# Altium project PT_PowerBench.PrjPcb
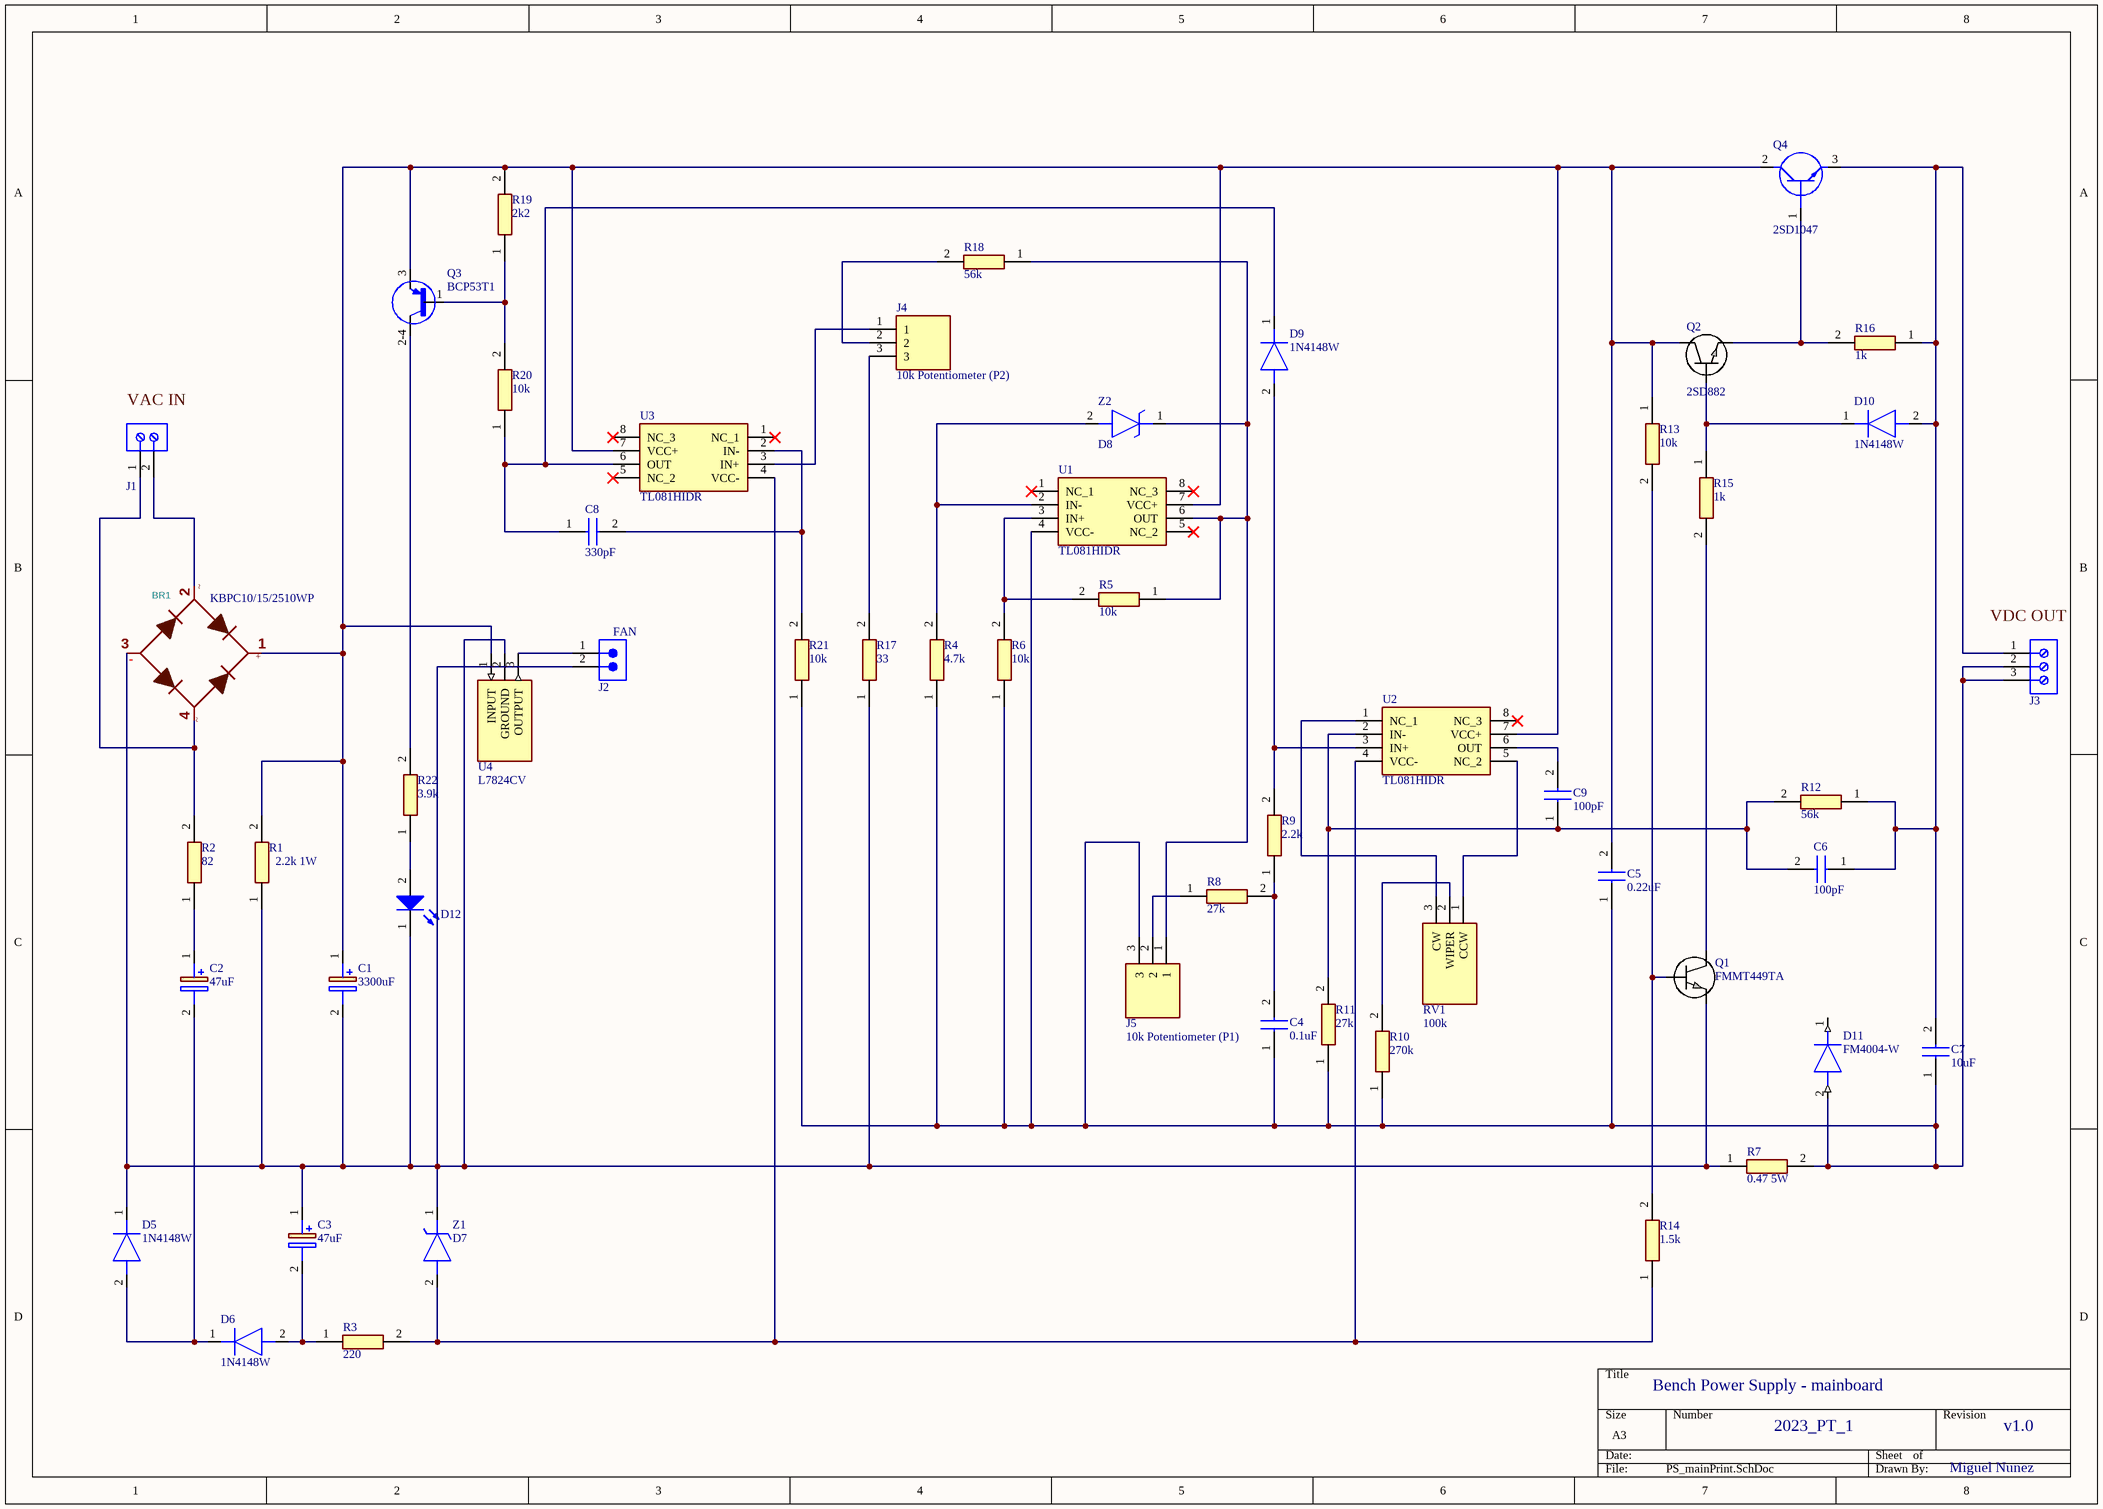
[diagram p0: PS_mainPrint.SchDoc]
2 sheets, 54 parts. Net scope: global (net labels, ports and power ports of the same name join across sheets).
Board file: PS_mainPcb.PcbDoc
Sheets:
  PS_mainPrint.SchDoc
  PS_voltAmpMeterPrint.SchDoc

## Sheet PS_mainPrint.SchDoc
size A3; SheetNumber: 1; SheetTotal: 1

### Parts
BR1  KBPC10/15/2510WP  [KBPCxxxxWP]
C1  3300uF  [CAPPRD500W60D1050H1350]
C2  47uF  [CAPPRD750W80D1850H4250]
C3  47uF  [CAPPRD750W80D1850H4250]
C4  0.1uF  [CAPC2012X145N]
C5  0.22uF  [CAPC2012X145N]
C6  100pF  [CAPC2012X145N]
C7  10uF  [CAPC2012X145N]
C8  330pF  [CAPC2012X145N]
C9  100pF  [CAPC2012X145N]
D5  1N4148W  [SOD3816X135N]
D6  1N4148W  [SOD3816X135N]
D9  1N4148W  [SOD3816X135N]
D10  1N4148W  [SOD3816X135N]
D11  FM4004-W  [DIONM5025X231N]
D12  Blue, 3.2V, 140°  [WL-SMCW_0805_150080xx75000]  (value not drawn)
J1  24VAC INPUT  [691103110002]  (value not drawn)
J2  FAN  [61900211121]
J3  TermBlock 3p  [691103110003]  (value not drawn)
J4  10k Potentiometer (P2)  [SHDR3W79P0X254_1X3_762X580X1175P]
J5  10k Potentiometer (P1)  [SHDR3W79P0X254_1X3_762X580X1175P]
Q1  FMMT449TA  [SOT-23_2P9X1P3_DIO]
Q2  2SD882  [SOT-32_STM]
Q3  BCP53T1  [TRANS_BCP53T1]
Q4  2SD1047  [TO545P500X1560X2360-3P]
R1  2.2k 1W  [RESC5025X70N]
R2  82  [RESC2012X60N]
R3  220  [RESC2012X60N]
R4  4.7k  [RESC2012X60N]
R5  10k  [RESC2012X60N]
R6  10k  [RESC2012X60N]
R7  0.47 5W  [RESAD4800W83L1800D750]
R8  27k  [RES_CRCW_1206_VIS-M]
R9  2.2k  [RESC2012X60N]
R10  270k  [RESC5025X70N]
R11  27k  [RES_CRCW_1206_VIS-M]
R12  56k  [RESC2012X60N]
R13  10k  [RESC2012X60N]
R14  1.5k  [RES_CRCW_1206_VIS-M]
R15  1k  [RESC5025X70N]
R16  1k  [RESC5025X70N]
R17  33  [RESC2012X60N]
R18  56k  [RESC2012X60N]
R19  2k2  [RESC2012X60N]
R20  10k  [RESC2012X60N]
R21  10k  [RESC2012X60N]
R22  3.9k  [RESC2012X60N]
RV1  100k  [3296W-1]
U1  TL081HIDR  [SOIC127P600X175-8N]
U2  TL081HIDR  [SOIC127P600X175-8N]
U3  TL081HIDR  [SOIC127P600X175-8N]
U4  L7824CV  [TO270P460X1020X2008-3P]
Z1  D7  [SOD3716X135N]
Z2  D8  [SOD3716X135N]

### Nets
NetBR1_1: BR1.1(+) C1.1(+) C5.2 Q2.2(C) Q3.3(E) Q4.2(C) R1.2 R13.1 R19.2 U1.7(VCC+) U2.7(VCC+) U3.7(VCC+) U4.1(INPUT)
NetBR1_2: BR1.2(Input_~) J1.2
NetBR1_3: BR1.3(-) C1.2(-) C3.1(+) D5.1(K) D12.1(K) J2.2 Q1.3(VCC) R1.1 R7.1 R17.1 U4.2(GROUND) Z1.1(K)
NetBR1_4: BR1.4(Input_~) J1.1 R2.2
NetC2_1: C2.1(+) R2.1
NetC2_2: C2.2(-) D5.2(A) D6.1(K)
NetC3_2: C3.2(-) D6.2(A) R3.1
NetC4_1: C4.1 C5.1 C7.1 D11.2(A) J3.2 J3.3 J5.3 R4.1 R6.1 R7.2 R10.1 R11.1 R21.1 U1.4(VCC-)
NetC4_2: C4.2 R8.2 R9.1
NetC6_1: C6.1 C7.2 D10.2(A) J3.1 Q4.3(E) R12.1 R16.1
NetC6_2: C6.2 C9.1 R11.2 R12.2 U2.2(IN-)
NetC8_1: C8.1 D9.1(K) R20.1 U3.6(OUT)
NetC8_2: C8.2 R21.2 U3.2(IN-)
NetC9_2: C9.2 U2.6(OUT)
NetD9_2: D9.2(A) R9.2 U2.3(IN+)
NetD10_1: D10.1(K) Q2.1(B) R15.1
NetD12_2: D12.2(A) R22.1
NetJ2_1: J2.1 U4.3(OUTPUT)
NetJ4_1: J4.1 U3.3(IN+)
NetJ4_2: J4.2 R18.2
NetJ4_3: J4.3 R17.2
NetJ5_1: J5.1 R5.1 R18.1 U1.6(OUT) Z2.1(K)
NetJ5_2: J5.2 R8.1
NetQ1_1: Q1.1(GND) R13.2 R14.2
NetQ1_2: Q1.2(RESET) R15.2
NetQ2_3: Q2.3(E) Q4.1(B) R16.2
NetQ3_1: Q3.1(B) R19.1 R20.2
NetQ3_2-4: Q3.2-4(C) R22.2
NetR3_2: R3.2 R14.1 U2.4(VCC-) U3.4(VCC-) Z1.2(A)
NetR4_2: R4.2 U1.2(IN-) Z2.2(A)
NetR5_2: R5.2 R6.2 U1.3(IN+)
NetR10_2: R10.2 RV1.2(WIPER)
NetRV1_1: RV1.1(CCW) U2.5(NC_2)
NetRV1_3: RV1.3(CW) U2.1(NC_1)

Not connected (* = marked no-connect by the designer): D11 1(K); Q3 2(C); U1 1(NC_1)* 5(NC_2)* 8(NC_3)*; U2 8(NC_3)*; U3 1(NC_1)* 5(NC_2)* 8(NC_3)*

### Notes on the sheet
- (near J1) VAC IN
- (near J3) VDC OUT
- Bench Power Supply - mainboard
- 2023_PT_1
- v1.0
- Miguel Nunez
- (in symbol Bridge_1ph) ~

### Library data of the parts
BR1 = Bridge_1ph: ki_keywords: Bridge 1 phase; ki_description: Bridge_1_phase; Datasheet: https://diotec.com/de/produktliste/B1.html
C1 = MAL213668479E3: Capacitor Polarised MAL213668479E3; Manufacturer_Name: Vishay; Datasheet Link: https://www.vishay.com/docs/28321/136rvi.pdf; Height: 13.5mm; Manufacturer_Part_Number: MAL213668479E3; Mouser Part Number: 594-2222-136-68479; Mouser Price/Stock: https://www.mouser.com/Search/Refine.aspx?Keyword=594-2222-136-68479; Arrow Part Number: MAL213668479E3; Arrow Price/Stock: https://www.arrow.com/en/products/mal213668479e3/vishay
C2 C3 = MAL215051332E3: Capacitor Polarised MAL215051332E3; Manufacturer_Name: Vishay; Datasheet Link: https://componentsearchengine.com/Datasheets/2/MAL215051332E3.pdf; Height: 42.5mm; Manufacturer_Part_Number: MAL215051332E3; Mouser Part Number: 594-MAL215051332E3; Mouser Price/Stock: https://www.mouser.co.uk/ProductDetail/Vishay-BC-Components/MAL215051332E3?qs=u16ybLDytRanS1IdIGWpyw%3D%3D
C4-C9 = Capacitor cer. 0805: Capacitor C2012X7T2E104K125AE; Manufacturer_Name: TDK; Datasheet Link: https://product.tdk.com/info/en/catalog/datasheets/mlcc_commercial_midvoltage_en.pdf; Height: 1.45mm; Manufacturer_Part_Number: C2012X7T2E104K125AE; Mouser Part Number: 810-C2012X7T2E104KST; Mouser Price/Stock: https://www.mouser.co.uk/ProductDetail/TDK/C2012X7T2E104K125AE?qs=LcTL%2F5vFEzGYUjuxGhm2jA%3D%3D; Arrow Part Number: C2012X7T2E104K125AE; Arrow Price/Stock: https://www.arrow.com/en/products/c2012x7t2e104k125ae/tdk?region=nac
D5 D6 D9 D10 = 1N4148W_R1_00001: Diode 1N4148W_R1_00001; Manufacturer_Name: PANJIT; Datasheet Link: https://www.mouser.com/datasheet/2/1057/1N4148W-1869619.pdf; Height: 1.35mm; Manufacturer_Part_Number: 1N4148W_R1_00001; Mouser Part Number: 241-1N4148W_R1_00001; Mouser Price/Stock: https://www.mouser.co.uk/ProductDetail/Panjit/1N4148W_R1_00001?qs=sPbYRqrBIVnqVztCqPNVrw%3D%3D
D11 = FM4004-W: Diode; Manufacturer_Name: Rectron; Datasheet Link: https://componentsearchengine.com/Datasheets/1/FM4004-W.pdf; Height: 2.31mm; Manufacturer_Part_Number: FM4004-W; Mouser Part Number: 583-FM4004; Mouser Price/Stock: https://www.mouser.co.uk/ProductDetail/Rectron/FM4004-W?qs=Iw9Ubr57Px3IHNH1bE4l9w%3D%3D; Arrow Part Number: FM4004-W; Arrow Price/Stock: https://www.arrow.com/en/products/fm4004-w/rectron?region=nac
D12 = 150080BS75000: WL-SMCW Mono-color Chip LED Waterclear, size 0805, Blue, 3.2V, 140°; Manufacturer: Wurth Elektronik; Case/Size Code: 0805; Chip Technology: InGaN; Dominant Wavelength: 470nm; Luminous Intensity: 145mcd; Peak Wavelength: 465nm; Manufacturer Part Number: 150080BS75000; Category: Signal LEDs; Match Code: WL-SMCW; ComponentLink1Description: Website Link; ComponentLink1URL: https://www.we-online.com/redexpert/article/150080BS75000?ad; ComponentLink2Description: Datasheet Link; ComponentLink2URL: https://www.we-online.com/redexpert/spec/150080BS75000?ad; Mount: Surface Mount; Operating Temperature Max: 85°C; Operating Temperature Min: -40°C; Packaging: Tape and Reel; Length: 2mm; Width: 1.25mm; Height: 0.7mm; Emitting Color: Blue; Forward Voltage: 3.2V; Viewing Angle: 140°
J1 = 691103110002: WR-TBL Series 1031 Horizontal Entry Modular, THT, pitch 3.5mm, 2p 691103110002; Manufacturer: Wurth Elektronik; Modularity: Yes; Rated Current: 10A; Working Voltage: 125V; ComponentLink1Description: Website Link; ComponentLink1URL: https://www.we-online.com/redexpert/article/691103110002?ad; ComponentLink2Description: Datasheet Link; ComponentLink2URL: https://www.we-online.com/redexpert/spec/691103110002?ad; Manufacturer Part Number: 691103110002; Category: Terminal Blocks; Match Code: WR-TBL; Mount: Through Hole; Operating Temperature Max: 105°C; Operating Temperature Min: -40°C; Packaging: Box; Application: Pressure Clamp; Number of Pins: 2; Number of Rows: 1; Orientation: Horizontal; Pitch: 3.5mm
J2 = 61900211121: WR-WTB THT Male Vertical Locking Header, pitch 2.54mm, 2pins 61900211121; Manufacturer: Wurth Elektronik; Contact Resistance: 20mΩ; Rated Current: 3A; Working Voltage: 250VAC; Withstanding Voltage: 1000VAC; ComponentLink1Description: Website Link; ComponentLink1URL: https://www.we-online.com/redexpert/article/61900211121?ad; ComponentLink2Description: Datasheet Link; ComponentLink2URL: https://www.we-online.com/redexpert/spec/61900211121?ad; Manufacturer Part Number: 61900211121; Category: Wire-to-Board Connectors; Match Code: WR-WTB; Mount: Through Hole; Operating Temperature Max: 105°C; Operating Temperature Min: -40°C; Packaging: Bag; Length: 5.08mm; Width: 5.8mm; Height: 11.5mm; Gender: Male; Number of Pins: 2; Number of Rows: 1; Orientation: Vertical; Pitch: 2.54mm
J3 = 691103110003: WR-TBL Series 1031 Horizontal Entry Modular, THT, pitch 3.5mm, 3p  691103110003; Manufacturer: Wurth Elektronik; Modularity: Yes; Rated Current: 10A; Working Voltage: 125V; ComponentLink1Description: Website Link; ComponentLink1URL: https://www.we-online.com/redexpert/article/691103110003?ad; ComponentLink2Description: Datasheet Link; ComponentLink2URL: https://www.we-online.com/redexpert/spec/691103110003?ad; Manufacturer Part Number: 691103110003; Category: Terminal Blocks; Match Code: WR-TBL; Mount: Through Hole; Operating Temperature Max: 105°C; Operating Temperature Min: -40°C; Packaging: Box; Application: Pressure Clamp; Number of Pins: 3; Number of Rows: 1; Orientation: Horizontal; Pitch: 3.5mm
J4 J5 = 61900311121: Connector 3pin; Manufacturer_Name: Wurth Elektronik; Datasheet Link: https://katalog.we-online.de/em/datasheet/61900311121.pdf; Height: 11.75mm; Manufacturer_Part_Number: 61900311121
Q1 = FMMT449TA: No Description Available; Mfr_Name: Diodes Inc; Type: DEV; Copyright: Copyright (C) 2023 Ultra Librarian. All rights reserved.; Manufacturer_Part_Number: FMMT449TA; RefDes: RefDes
Q2 = 2SD882: No Description Available; Mfr_Name: STMicroelectronics; Type: DEV; Copyright: Copyright (C) 2023 Ultra Librarian. All rights reserved.; Manufacturer_Part_Number: 2SD882; RefDes: RefDes
Q3 = BCP53T1: Bipolar (BJT) Transistor PNP 80 V 1.5 A 50MHz 1.5 W Surface Mount SOT-223 (TO-261); MF: ON Semiconductor; Package: TO-261-4 ON Semiconductor; Price: None; Value: *; SnapEDA_Link: https://www.snapeda.com/parts/BCP53T1/Onsemi/view-part/?ref=snap; MP: BCP53T1; Availability: In Stock; Check_prices: https://www.snapeda.com/parts/BCP53T1/Onsemi/view-part/?ref=eda
Q4 = 2SD1047: Transistor BJT NPN; Manufacturer_Name: STMicroelectronics; Datasheet Link: http://www.st.com/content/ccc/resource/technical/document/datasheet/b3/86/80/4e/89/45/4b/6d/DM00026462.pdf/files/DM00026462.pdf/jcr:content/translations/en.DM00026462.pdf; Height: 5mm; Manufacturer_Part_Number: 2SD1047; Mouser Part Number: 511-2SD1047; Mouser Price/Stock: https://www.mouser.co.uk/ProductDetail/STMicroelectronics/2SD1047?qs=AHLdMMsI%252BhoLOT4krJ7z2g%3D%3D; Arrow Part Number: 2SD1047; Arrow Price/Stock: https://www.arrow.com/en/products/2sd1047/stmicroelectronics?region=nac
R1 = CRCW2010: Resistor 2.2k 1W CRCW20102K20JNEFHP; Manufacturer_Name: ROHM Semiconductor; Manufacturer_Part_Number: ESR10EZPJ472; Datasheet Link: https://componentsearchengine.com/Datasheets/2/ESR10EZPJ472.pdf; Height: 0.65mm
R2-R6 R9 R12 R13 R17-R22 = CRCW0805: Resistor CRCW0805; Manufacturer_Name: Vishay; Manufacturer_Part_Number: CRCW080582R0FKEAHP; Datasheet Link: https://componentsearchengine.com/Datasheets/1/CRCW08051R00FKEAHP.pdf; Height: 0.6mm; Mouser Part Number: 71-CRCW080582R0FKEAH; Mouser Price/Stock: https://www.mouser.com/Search/Refine.aspx?Keyword=71-CRCW080582R0FKEAH
R7 = AC05000004707JAC00: Resistor 0.47 5W AC05000004707JAC00; Manufacturer_Name: Vishay; Datasheet Link: https://www.vishay.com/docs/28730/acac-at.pdf; Manufacturer_Part_Number: AC05000004707JAC00; Mouser Part Number: 594-AC05W0R470J; Mouser Price/Stock: https://www.mouser.co.uk/ProductDetail/Vishay-Draloric/AC05000004707JAC00?qs=9EcTHFQkrt89eb2J9Rg7Vw%3D%3D; Arrow Part Number: AC05000004707JAC00; Arrow Price/Stock: https://www.arrow.com/en/products/ac05000004707jac00/vishay
R8 R11 = CRCW1206: Resistor CRCW1206; Manufacturer_Name: Vishay; Manufacturer_Part_Number: CRCW080582R0FKEAHP; Datasheet Link: https://componentsearchengine.com/Datasheets/1/CRCW08051R00FKEAHP.pdf; Height: 0.6mm; Mouser Part Number: 71-CRCW080582R0FKEAH; Mouser Price/Stock: https://www.mouser.com/Search/Refine.aspx?Keyword=71-CRCW080582R0FKEAH
R10 R15 R16 = CRCW2010: Resistor 270k CRCW20102K20JNEFHP; Manufacturer_Name: ROHM Semiconductor; Manufacturer_Part_Number: ESR10EZPJ472; Datasheet Link: https://componentsearchengine.com/Datasheets/2/ESR10EZPJ472.pdf; Height: 0.65mm
R14 = CRCW1206: Resistor 1.5k 1206; Manufacturer_Name: Vishay; Manufacturer_Part_Number: CRCW080582R0FKEAHP; Datasheet Link: https://componentsearchengine.com/Datasheets/1/CRCW08051R00FKEAHP.pdf; Height: 0.6mm; Mouser Part Number: 71-CRCW080582R0FKEAH; Mouser Price/Stock: https://www.mouser.com/Search/Refine.aspx?Keyword=71-CRCW080582R0FKEAH
RV1 = 3296W-1-104LF: Variable Resistor 3296W-1-104LF; Manufacturer_Name: Bourns; Datasheet Link: https://datasheet.datasheetarchive.com/originals/distributors/Datasheets-10/DSA-187647.pdf; Manufacturer_Part_Number: 3296W-1-104LF; Mouser Part Number: 652-3296W-1-104LF; Mouser Price/Stock: https://www.mouser.co.uk/ProductDetail/Bourns/3296W-1-104LF?qs=NxuKWO2Bm4Yv9t2iisRb6w%3D%3D; Arrow Part Number: 3296W-1-104LF; Arrow Price/Stock: https://www.arrow.com/en/products/3296w-1-104lf/bourns?region=europe
U1-U3 = TL081HIDR: Integrated Circuit; Manufacturer_Name: Texas Instruments; Datasheet Link: https://www.ti.com/lit/ds/symlink/tl081h.pdf?ts=1631512685982&ref_url=https%253A%252F%252Fcomponentsearchengine.com%252F; Height: 1.75mm; Manufacturer_Part_Number: TL081HIDR; Mouser Part Number: 595-TL081HIDR; Mouser Price/Stock: https://www.mouser.co.uk/ProductDetail/Texas-Instruments/TL081HIDR?qs=pBJMDPsKWf2IEA%252Bv86wIaw%3D%3D; Arrow Part Number: TL081HIDR; Arrow Price/Stock: https://www.arrow.com/en/products/tl081hidr/texas-instruments?region=nac
U4 = L7824CV: Integrated Circuit LDO 24V; Manufacturer_Name: STMicroelectronics; Datasheet Link: http://www.st.com/web/en/resource/technical/document/datasheet/CD00000444.pdf; Height: 4.6mm; Manufacturer_Part_Number: L7824CV; Mouser Part Number: 511-L7824CV; Mouser Price/Stock: https://www.mouser.co.uk/ProductDetail/STMicroelectronics/L7824CV?qs=GQP%2FxgjKl96cWFC%252B68wxSg%3D%3D; Arrow Part Number: L7824CV; Arrow Price/Stock: https://www.arrow.com/en/products/l7824cv/stmicroelectronics?region=europe
Z1 Z2 = BZT52C5V1-E3-08: Zener Diode BZT52C5V1-E3-08; Manufacturer_Name: Vishay; Datasheet Link: https://www.vishay.com/docs/85760/bzt52.pdf; Height: 1.35mm; Manufacturer_Part_Number: BZT52C5V1-E3-08; Mouser Part Number: 78-BZT52C5V1-E3-08; Mouser Price/Stock: https://www.mouser.co.uk/ProductDetail/Vishay-Semiconductors/BZT52C5V1-E3-08?qs=KP8Io%2FXyE5QYxn8yJkvjqQ%3D%3D; Arrow Part Number: BZT52C5V1-E3-08; Arrow Price/Stock: https://www.arrow.com/en/products/bzt52c5v1-e3-08/vishay?region=nac

## Sheet PS_voltAmpMeterPrint.SchDoc
size A3; SheetNumber: 2; SheetTotal: 2